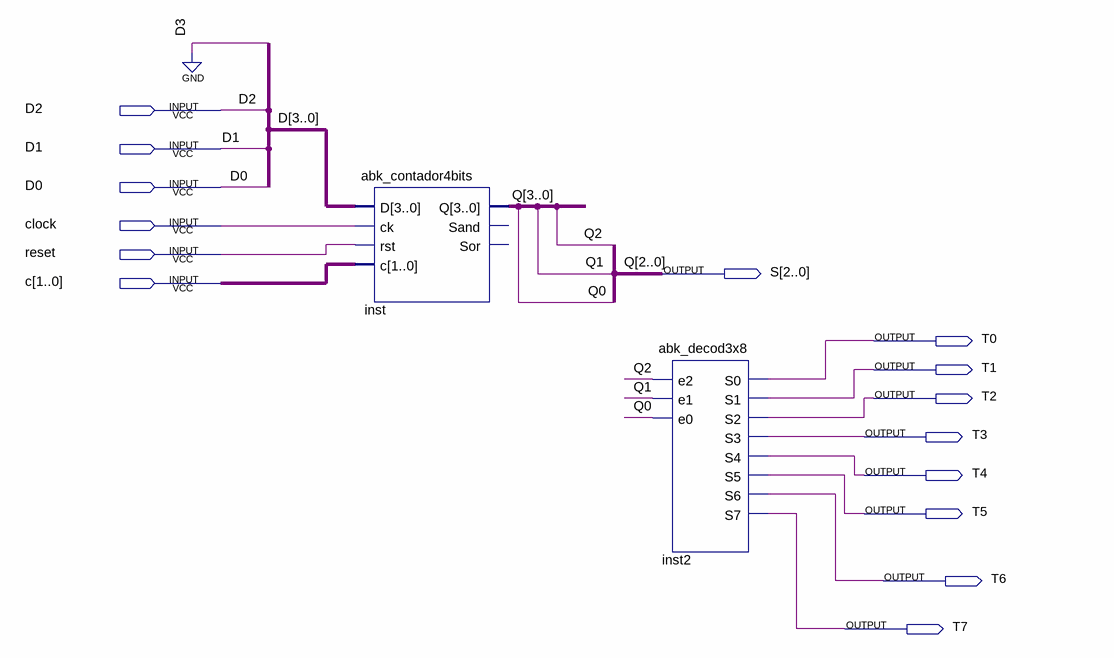
[diagram p0: schematic sheet]
// Quartus schematic abk_gambiarra.bdf as structural Verilog: 2 symbols, 15 pins
module abk_gambiarra (
  input  D2,
  input  D1,
  input  D0,
  input  clock,
  input  reset,
  input  [1:0] c,
  output [2:0] S,
  output T0,
  output T1,
  output T2,
  output T3,
  output T4,
  output T5,
  output T6,
  output T7
);

  wire [3:3] Q;

  abk_contador4bits inst (.D({1'b0, D2, D1, D0}), .ck(clock), .rst(reset), .c(c), .Q({Q[3], S}));  // open: Sand, Sor
  abk_decod3x8 inst2 (
    .e2(S[2]), .e1(S[1]), .e0(S[0]), .S0(T0), .S1(T1), .S2(T2), .S3(T3), .S4(T4), .S5(T5), .S6(T6), .S7(T7));

  // Other names for the same wires on the sheet: Q[2:0] = S; Q0 = S[0]; Q1 = S[1]; Q2 = S[2]
endmodule
